# Altium schematic sheet SRD Generator scheme.SchDoc
size A4; SheetNumber: 1; SheetTotal: 1
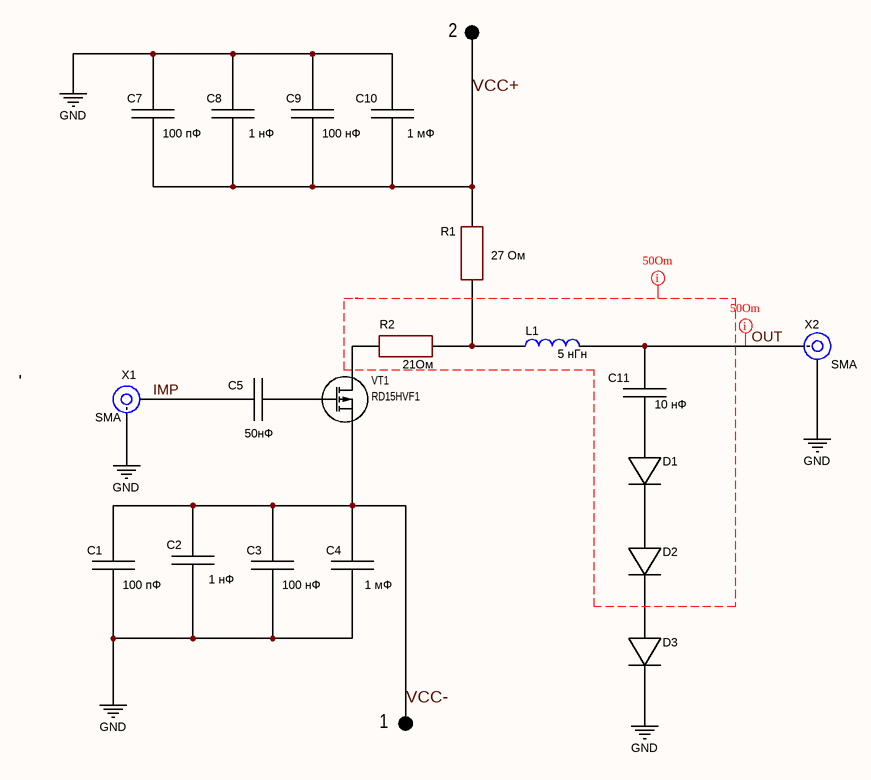
[diagram p0: SRD Generator scheme.SchDoc]

## Parts
1  SMD, 1.5x1.5mm  [Test point Rectan SMD]  (value not drawn)
2  SMD, 1.5x1.5mm  [Test point Rectan SMD]  (value not drawn)
C1  100 пФ  [CH0603C]
C2  1 нФ  [CH0603C]
C3  100 нФ  [CH0603C]
C4  1 мФ  [CH0603C]
C5  50нФ  [CH0603C]
C7  100 пФ  [CH0603C]
C8  1 нФ  [CH0603C]
C9  100 нФ  [CH0603C]
C10  1 мФ  [CH0603C]
C11  10 нФ  [CH0603C]
D1  SRD  [Diode Macom]  (value not drawn)
D2  SRD  [Diode Macom]  (value not drawn)
D3  SRD  [Diode Macom]  (value not drawn)
L1  value 5 нГн  [0402-A]  (hidden comment: Inductor)
R1  27 Ом  [R2512]
R2  21Ом  [CH0603R]
VT1  RD15HVF1  [TO220_123]
X1  SMA  [SMA-90deg]
X2  SMA  [SMA-90deg]

## Nets
GND: C1.1 C2.1 C3.1 C4.1 C7.2 C8.2 C9.2 C10.2 D3.2(К) X1.2(IN) X2.2(IN)
IMP: C5.1 X1.1(IN)
OUT: C11.2 L1.2 X2.1(IN)
VCC+: 2.1 C7.1 C8.1 C9.1 C10.1 R1.2
VCC-: 1.1 C1.2 C2.2 C3.2 C4.2 VT1.3(S)
NetC5_2: C5.2 VT1.1(G)
NetC11_1: C11.1 D1.1(A)
NetD1_2: D1.2(К) D2.1(A)
NetD2_2: D2.2(К) D3.1(A)
NetL1_1: L1.1 R1.1 R2.1
NetR2_2: R2.2 VT1.2(D)

## Layout directives
net class 50Om: (no net found under the mark), OUT

## Library data of the parts
1 2 = Test point Rectan SMD: Part Number: Test point Rectan SMD
C1-C4 C7-C11 = Capacitor: Value: 50 нФ; Manufacturer: *; Model: *; HelpURL: *; ComponentKind: *; Name: *
C5 = Capacitor_1: Value: 100 нФ; Manufacturer: *; Model: *; HelpURL: *; ComponentKind: *; Name: *
D1-D3 = SRD: https://ru.mouser.com/datasheet/2/249/maom_s_a0004987266_1-2274246.pdf
L1 = Inductor: Code_IEC: 1005; Published: 8-Jun-2000; LatestRevisionDate: 29-May-2009; LatestRevisionNote: IPC-7351 Footprint Added.; PackageReference: 0402-A; Publisher: Altium Limited; PackageDescription: Chip Inductor; Code_JEITA: 0402
R1 = Resistor: Manufacturer: *; Model: *; HelpURL: *; ComponentKind: *; Value: 27 Ом; Name: *
R2 = Resistor_1: Manufacturer: *; Model: *; HelpURL: *; ComponentKind: *; Value: 21Ом; Name: *
VT1 = P-chanel -diod: Mosfet; Model: RD15HVF1; Manufacturer: *; ComponentKind: *; HelpURL: http://www.mitsubishielectric.com/semiconductors/content/product/highfrequency/siliconrf/discrete/rd15hvf1.pdf
X1 X2 = SMA: RF; Model: *; Manufacturer: *; ComponentKind: *; Docs: *